# Altium schematic sheet PICKIT2-Original-WithOut-Memory.SchDoc
size A3
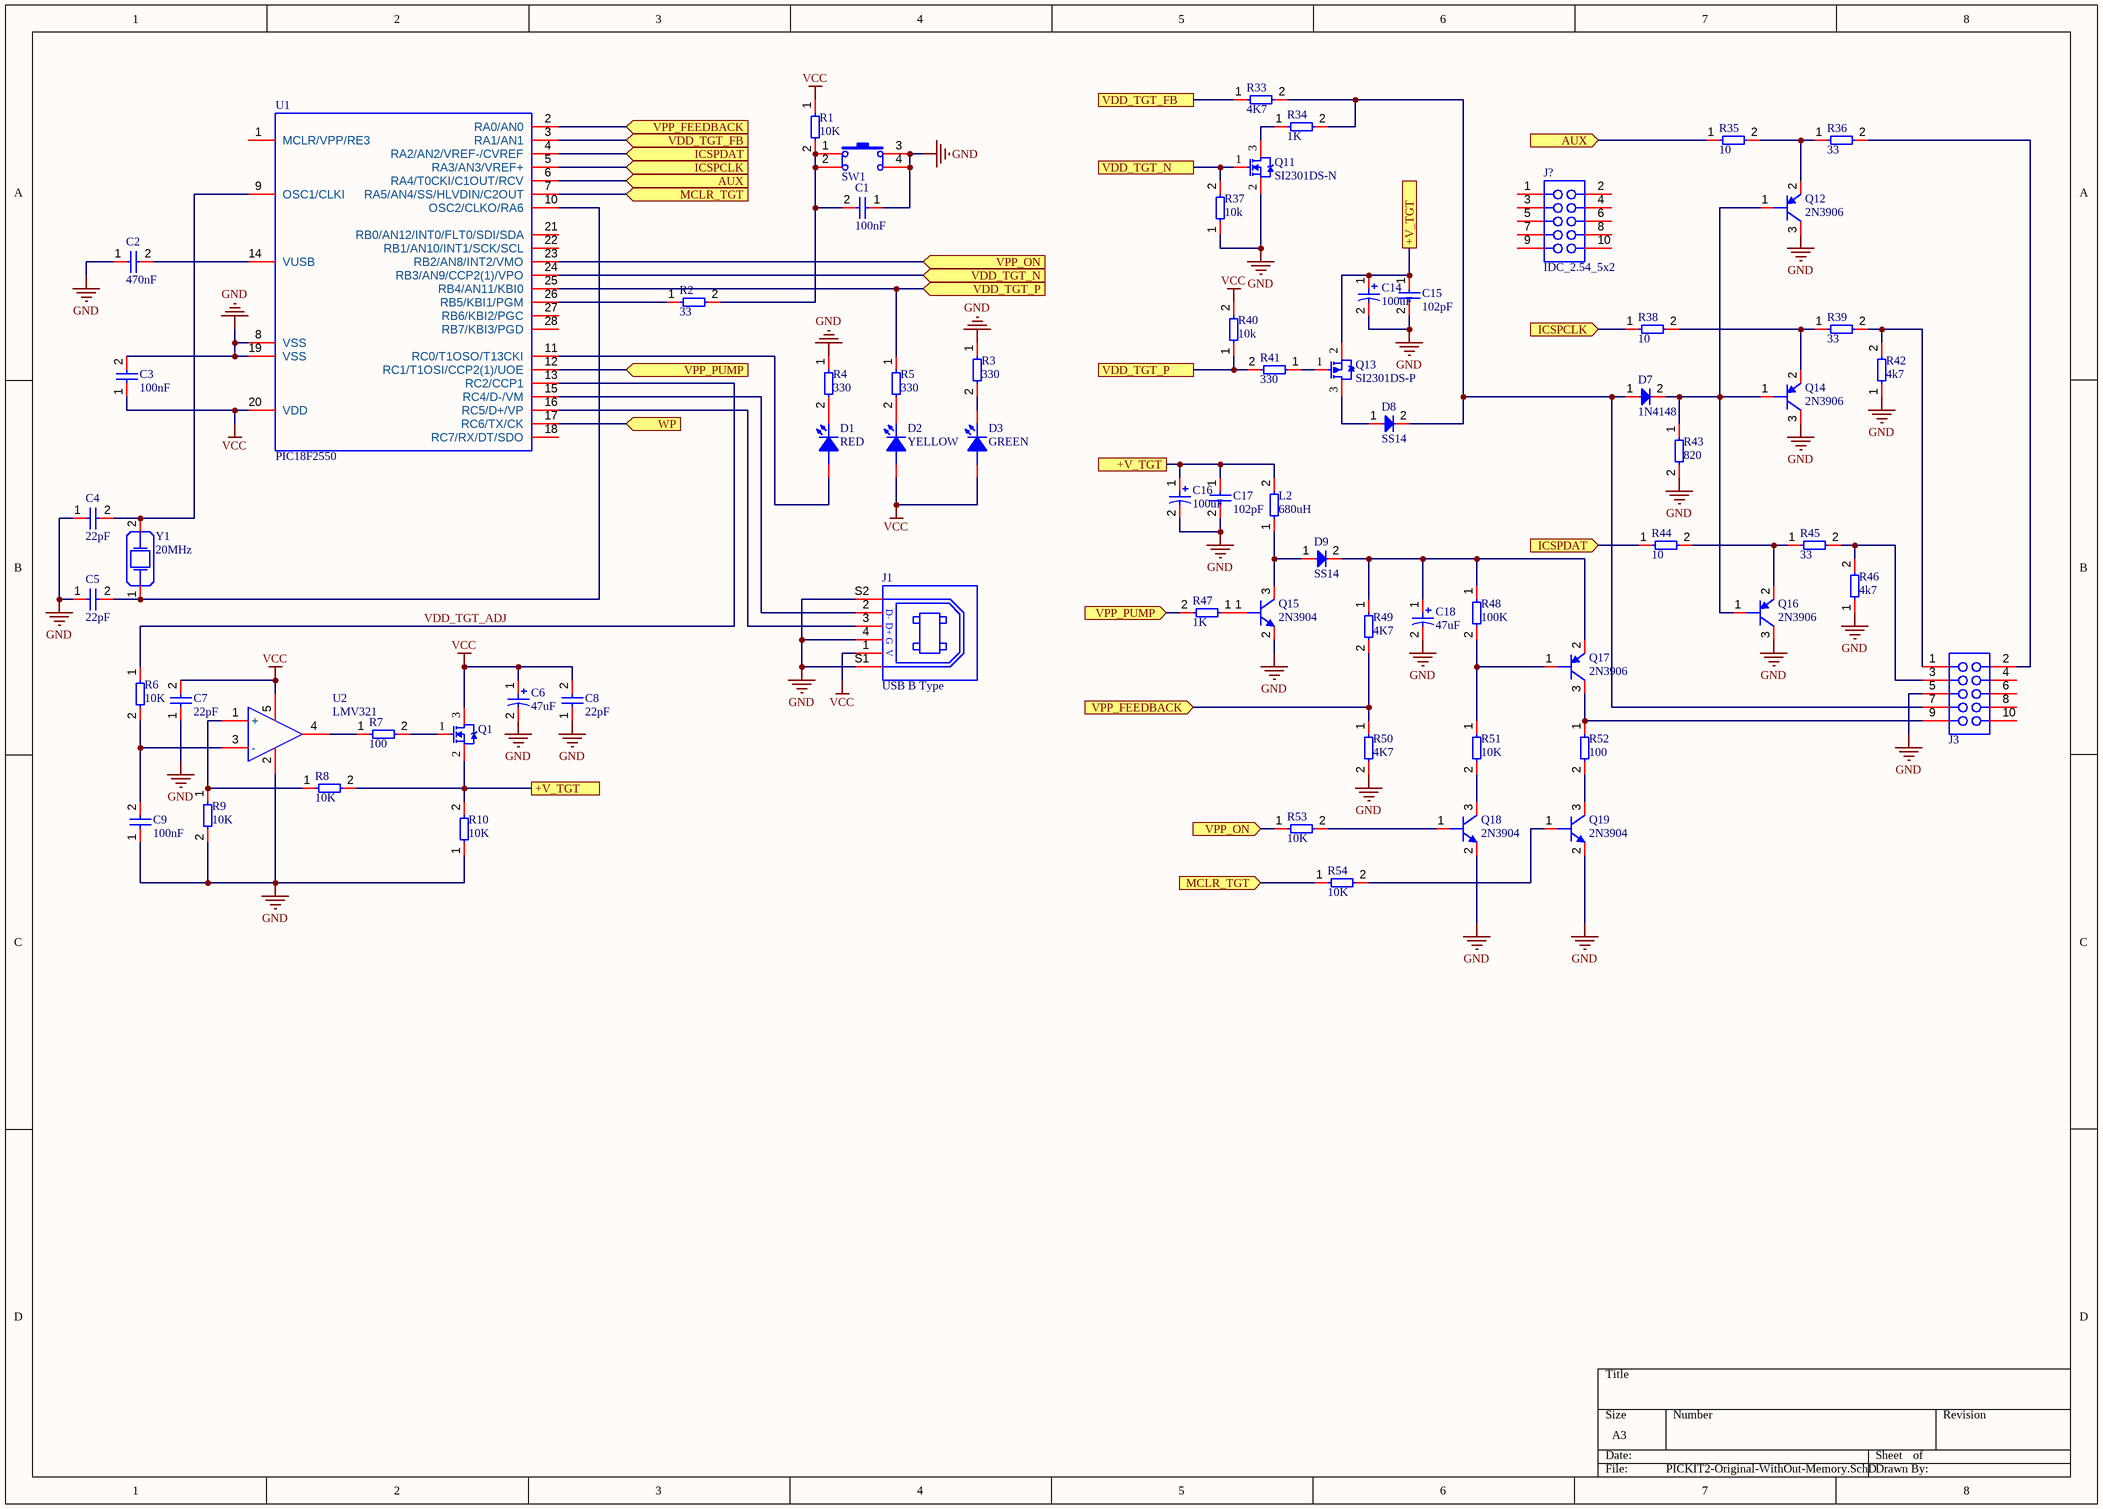
[diagram p0: PICKIT2-Original-WithOut-Memory.SchDoc]

## Parts
C1  100nF  [C0805]
C2  470nF  [C0805]
C3  100nF  [C0805]
C4  22pF  [C0805]
C5  22pF  [C0805]
C6  47uF  [CAP_RAD_4mm]
C7  22pF  [C0805]
C8  22pF  [C0805]
C9  100nF  [C0805]
C14  100uF  [CAP_RAD_4mm]
C15  102pF  [C0805]
C16  100uF  [CAP_RAD_4mm]
C17  102pF  [C0805]
C18  47uF  [CAP_RAD_4mm]
D1  RED  [L0805RED]
D2  YELLOW  [L0805RED]
D3  GREEN  [L0805RED]
D7  1N4148  [SOD-80]
D8  SS14  [DO-214AC(SMA)]
D9  SS14  [DO-214AC(SMA)]
J1  USB B Type  [USB-B-TYPE]
J3  Header 5x2 TH Pitch 2.54mm  [Header 5x2 TH Pitch 2.54mm]  (value not drawn)
J?  IDC_2.54_5x2  [IDC_CONNECTOR_10x2.54]
L2  680uH  [RES-0.5W-HH-MF]
Q1  SI2301DS-N  [SOT23-3]  (value not drawn)
Q11  SI2301DS-N  [SOT23-3]
Q12  2N3906  [SOT23-3]
Q13  SI2301DS-P  [SOT23-3]
Q14  2N3906  [SOT23-3]
Q15  2N3904  [SOT23-3]
Q16  2N3906  [SOT23-3]
Q17  2N3906  [SOT23-3]
Q18  2N3904  [SOT23-3]
Q19  2N3904  [SOT23-3]
R1  10K  [R0805]
R2  33  [R0805]
R3  330  [R0805]
R4  330  [R0805]
R5  330  [R0805]
R6  10K  [R0805]
R7  100  [R0805]
R8  10K  [R0805]
R9  10K  [R0805]
R10  10K  [R0805]
R33  4K7  [R0805]
R34  1K  [R0805]
R35  10  [R0805]
R36  33  [R0805]
R37  10k  [R0805]
R38  10  [R0805]
R39  33  [R0805]
R40  10k  [R0805]
R41  330  [R0805]
R42  4k7  [R0805]
R43  820  [R0805]
R44  10  [R0805]
R45  33  [R0805]
R46  4k7  [R0805]
R47  1K  [R0805]
R48  100K  [R0805]
R49  4K7  [R0805]
R50  4K7  [R0805]
R51  10K  [R0805]
R52  100  [R0805]
R53  10K  [R0805]
R54  10K  [R0805]
SW1  Button Hole  [BUTTON_HOLE_5.0mm]  (value not drawn)
U1  PIC18F2550  [DIP28_M04]
U2  LMV321  [SOT23-5]
Y1  20MHz  [HC-49S]

## Ports
+V_TGT, AUX (in), ICSPCLK (in), ICSPDAT (in), MCLR_TGT (in), VDD_TGT_FB, VDD_TGT_FB (in), VDD_TGT_N, VDD_TGT_N (in), VDD_TGT_P, VDD_TGT_P (in), VPP_FEEDBACK (in), VPP_ON (in), VPP_PUMP (in), WP (in)

## Nets
GND: C1.1 C2.1 C3.2 C4.1 C5.1 C6.2 C7.1 C8.1 C9.1 C14.2 C15.2 C16.2 C17.2 C18.2 J1.4 J1.S1 J1.S2 J3.5 Q11.2(S) Q12.3(C) Q14.3(C) Q15.2(E) Q16.3(C) Q18.2(E) Q19.2(E) R3.1 R4.1 R9.2 R10.1 R37.1 R42.1 R43.2 R46.1 R50.2 SW1.3 SW1.4 U1.8(VSS) U1.19(VSS) U2.2
VCC: C3.1 C6.1 C7.2 C8.2 D2.1(A) D3.1(A) J1.1 Q1.3(D) R1.1 R40.2 U1.20(VDD) U2.5
+V_TGT: C14.1 C15.1 C16.1 C17.1 L2.2 Q1.2(S) Q13.2(S) R8.2 R10.2 ; port +V_TGT
AUX: R35.1 U1.6(RA4/T0CKI/C1OUT/RCV) ; port AUX
ICSPCLK: R38.1 U1.5(RA3/AN3/VREF+) ; port ICSPCLK
ICSPDAT: R44.1 U1.4(RA2/AN2/VREF-/CVREF) ; port ICSPDAT
MCLR_TGT: R54.1 U1.7(RA5/AN4/SS/HLVDIN/C2OUT) ; port MCLR_TGT
VDD_TGT_ADJ: R6.1 U1.13(RC2/CCP1)
VDD_TGT_FB: R33.1 U1.3(RA1/AN1) ; port VDD_TGT_FB
VDD_TGT_N: Q11.1(G) R37.2 U1.24(RB3/AN9/CCP2(1)/VPO) ; port VDD_TGT_N
VDD_TGT_P: R5.1 R40.1 R41.2 U1.25(RB4/AN11/KBI0) ; port VDD_TGT_P
VPP_FEEDBACK: R49.2 R50.1 U1.2(RA0/AN0) ; port VPP_FEEDBACK
VPP_ON: R53.1 U1.23(RB2/AN8/INT2/VMO) ; port VPP_ON
VPP_PUMP: R47.2 U1.12(RC1/T1OSI/CCP2(1)/UOE) ; port VPP_PUMP
WP: U1.17(RC6/TX/CK) ; port WP
NetC1_2: C1.2 R1.2 R2.2 SW1.1 SW1.2
NetC2_2: C2.2 U1.14(VUSB)
NetC4_2: C4.2 U1.9(OSC1/CLKI) Y1.2
NetC5_2: C5.2 U1.10(OSC2/CLKO/RA6) Y1.1
NetC9_2: C9.2 R6.2 U2.3(-)
NetC18_1: C18.1 D9.2 Q17.2(E) R48.1 R49.1
NetD1_1: D1.1(A) U1.11(RC0/T1OSO/T13CKI)
NetD1_2: D1.2(K) R4.2
NetD2_2: D2.2(K) R5.2
NetD3_2: D3.2(K) R3.2
NetD7_1: D7.1 D8.2 J3.7 R33.2 R34.2
NetD7_2: D7.2 Q12.1(B) Q14.1(B) Q16.1(B) R43.1
NetD8_1: D8.1 Q13.3(D)
NetD9_1: D9.1 L2.1 Q15.3(C)
NetJ1_2: J1.2 U1.15(RC4/D-/VM)
NetJ1_3: J1.3 U1.16(RC5/D+/VP)
NetJ3_1: J3.1 R39.2 R42.2
NetJ3_2: J3.2 R36.2
NetJ3_3: J3.3 R45.2 R46.2
NetJ3_9: J3.9 Q17.3(C) R52.1
NetQ1_1: Q1.1(G) R7.2
NetQ11_3: Q11.3(D) R34.1
NetQ12_2: Q12.2(E) R35.2 R36.1
NetQ13_1: Q13.1(G) R41.1
NetQ14_2: Q14.2(E) R38.2 R39.1
NetQ15_1: Q15.1(B) R47.1
NetQ16_2: Q16.2(E) R44.2 R45.1
NetQ17_1: Q17.1(B) R48.2 R51.1
NetQ18_1: Q18.1(B) R53.2
NetQ18_3: Q18.3(C) R51.2
NetQ19_1: Q19.1(B) R54.2
NetQ19_3: Q19.3(C) R52.2
NetR2_1: R2.1 U1.26(RB5/KBI1/PGM)
NetR7_1: R7.1 U2.4
NetR8_1: R8.1 R9.1 U2.1(+)

Not connected (* = marked no-connect by the designer): J3 4 6 8 10; J? 1 2 3 4 5 6 7 8 9 10; U1 1(MCLR/VPP/RE3) 18(RC7/RX/DT/SDO) 21(RB0/AN12/INT0/FLT0/SDI/SDA) 22(RB1/AN10/INT1/SCK/SCL) 27(RB6/KBI2/PGC) 28(RB7/KBI3/PGD)

## Notes on the sheet
- (in symbol USB B Type) D-; D+; G; V

## Library data of the parts
C1 C3-C5 C7-C9 = C0805
C2 C15 C17 = Capacitors(SMD)
C6 C14 C16 C18 = Capacitor(Radian)
D1-D3 = LED0805
D7 = 1N4148 (SOD-80)
D8 D9 = Diode 1N4007-DO214AC(SMA)
L2 = Resistors THD
R1-R10 R33-R54 = Resistor SMD
Y1 = Crystal